# Altium schematic sheet SMARC Pinout-2.SchDoc
size A4; SheetNumber: 6; SheetTotal: 10
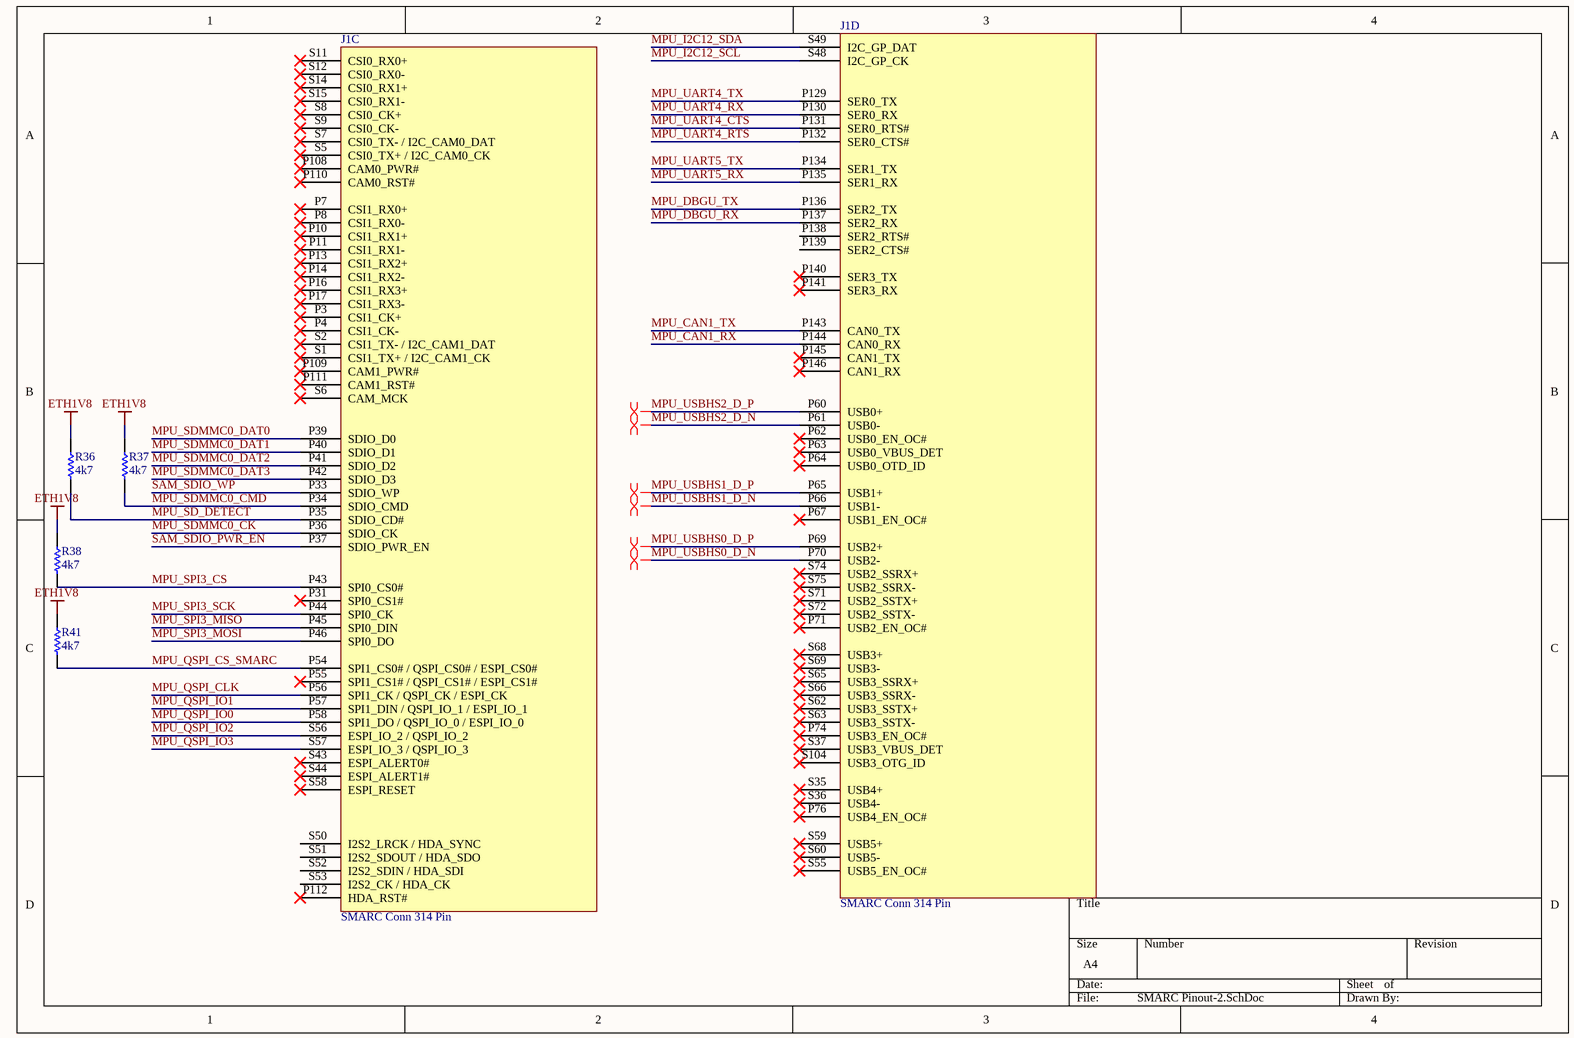
[diagram p0: SMARC Pinout-2.SchDoc]

## Parts
J1  SMARC Conn 314 Pin  [SMARC Conn 314 Pin]  (parts C,D of 6)
R36  4k7  [RES-0201]
R37  4k7  [RES-0201]
R38  4k7  [RES-0201]
R41  4k7  [RES-0201]

## Nets
ETH1V8: R36.2 R37.2 R38.2 R41.2
MPU_CAN1_RX: J1.P144(CAN0_RX)
MPU_CAN1_TX: J1.P143(CAN0_TX)
MPU_DBGU_RX: J1.P137(SER2_RX)
MPU_DBGU_TX: J1.P136(SER2_TX)
MPU_I2C12_SCL: J1.S48(I2C_GP_CK)
MPU_I2C12_SDA: J1.S49(I2C_GP_DAT)
MPU_QSPI_CLK: J1.P56(SPI1_CK_/_QSPI_CK_/_ESPI_CK)
MPU_QSPI_CS_SMARC: J1.P54(SPI1_CS0#_/_QSPI_CS0#_/_ESPI_CS0#) R41.1
MPU_QSPI_IO0: J1.P58(SPI1_DO_/_QSPI_IO_0_/_ESPI_IO_0)
MPU_QSPI_IO1: J1.P57(SPI1_DIN_/_QSPI_IO_1_/_ESPI_IO_1)
MPU_QSPI_IO2: J1.S56(ESPI_IO_2_/_QSPI_IO_2)
MPU_QSPI_IO3: J1.S57(ESPI_IO_3_/_QSPI_IO_3)
MPU_SD_DETECT: J1.P35(SDIO_CD#) R36.1
MPU_SDMMC0_CK: J1.P36(SDIO_CK)
MPU_SDMMC0_CMD: J1.P34(SDIO_CMD) R37.1
MPU_SDMMC0_DAT0: J1.P39(SDIO_D0)
MPU_SDMMC0_DAT1: J1.P40(SDIO_D1)
MPU_SDMMC0_DAT2: J1.P41(SDIO_D2)
MPU_SDMMC0_DAT3: J1.P42(SDIO_D3)
MPU_SPI3_CS: J1.P43(SPI0_CS0#) R38.1
MPU_SPI3_MISO: J1.P45(SPI0_DIN)
MPU_SPI3_MOSI: J1.P46(SPI0_DO)
MPU_SPI3_SCK: J1.P44(SPI0_CK)
MPU_UART4_CTS: J1.P131(SER0_RTS#)
MPU_UART4_RTS: J1.P132(SER0_CTS#)
MPU_UART4_RX: J1.P130(SER0_RX)
MPU_UART4_TX: J1.P129(SER0_TX)
MPU_UART5_RX: J1.P135(SER1_RX)
MPU_UART5_TX: J1.P134(SER1_TX)
MPU_USBHS0_D_N: J1.P70(USB2-)
MPU_USBHS0_D_P: J1.P69(USB2+)
MPU_USBHS1_D_N: J1.P66(USB1-)
MPU_USBHS1_D_P: J1.P65(USB1+)
MPU_USBHS2_D_N: J1.P61(USB0-)
MPU_USBHS2_D_P: J1.P60(USB0+)
SAM_SDIO_PWR_EN: J1.P37(SDIO_PWR_EN)
SAM_SDIO_WP: J1.P33(SDIO_WP)

Not connected (* = marked no-connect by the designer): J1 P3(CSI1_CK+)* P4(CSI1_CK-)* P7(CSI1_RX0+)* P8(CSI1_RX0-)* P10(CSI1_RX1+)* P11(CSI1_RX1-)* P13(CSI1_RX2+)* P14(CSI1_RX2-)* P16(CSI1_RX3+)* P17(CSI1_RX3-)* P31(SPI0_CS1#)* P55(SPI1_CS1#_/_QSPI_CS1#_/_ESPI_CS1#)* P62(USB0_EN_OC#)* P63(USB0_VBUS_DET)* P64(USB0_OTD_ID)* P67(USB1_EN_OC#)* P71(USB2_EN_OC#)* P74(USB3_EN_OC#)* P76(USB4_EN_OC#)* P108(CAM0_PWR#)* P109(CAM1_PWR#)* P110(CAM0_RST#)* P111(CAM1_RST#)* P112(HDA_RST#)* P138(SER2_RTS#) P139(SER2_CTS#) P140(SER3_TX)* P141(SER3_RX)* P145(CAN1_TX)* P146(CAN1_RX)* S1(CSI1_TX+_/_I2C_CAM1_CK)* S2(CSI1_TX-_/_I2C_CAM1_DAT)* S5(CSI0_TX+_/_I2C_CAM0_CK)* S6(CAM_MCK)* S7(CSI0_TX-_/_I2C_CAM0_DAT)* S8(CSI0_CK+)* S9(CSI0_CK-)* S11(CSI0_RX0+)* S12(CSI0_RX0-)* S14(CSI0_RX1+)* S15(CSI0_RX1-)* S35(USB4+)* S36(USB4-)* S37(USB3_VBUS_DET)* S43(ESPI_ALERT0#)* S44(ESPI_ALERT1#)* S50(I2S2_LRCK_/_HDA_SYNC) S51(I2S2_SDOUT_/_HDA_SDO) S52(I2S2_SDIN_/_HDA_SDI) S53(I2S2_CK_/_HDA_CK) S55(USB5_EN_OC#)* S58(ESPI_RESET)* S59(USB5+)* S60(USB5-)* S62(USB3_SSTX+)* S63(USB3_SSTX-)* S65(USB3_SSRX+)* S66(USB3_SSRX-)* S68(USB3+)* S69(USB3-)* S71(USB2_SSTX+)* S72(USB2_SSTX-)* S74(USB2_SSRX+)* S75(USB2_SSRX-)* S104(USB3_OTG_ID)*

## Layout directives
differential pair: MPU_USBHS0_D_N, MPU_USBHS0_D_P, MPU_USBHS1_D_N, MPU_USBHS1_D_P, MPU_USBHS2_D_N, MPU_USBHS2_D_P

## Library data of the parts
R36-R38 R41 = RES-0201: Resistor chip. 0201